# Altium project smart green_house.PrjPcb
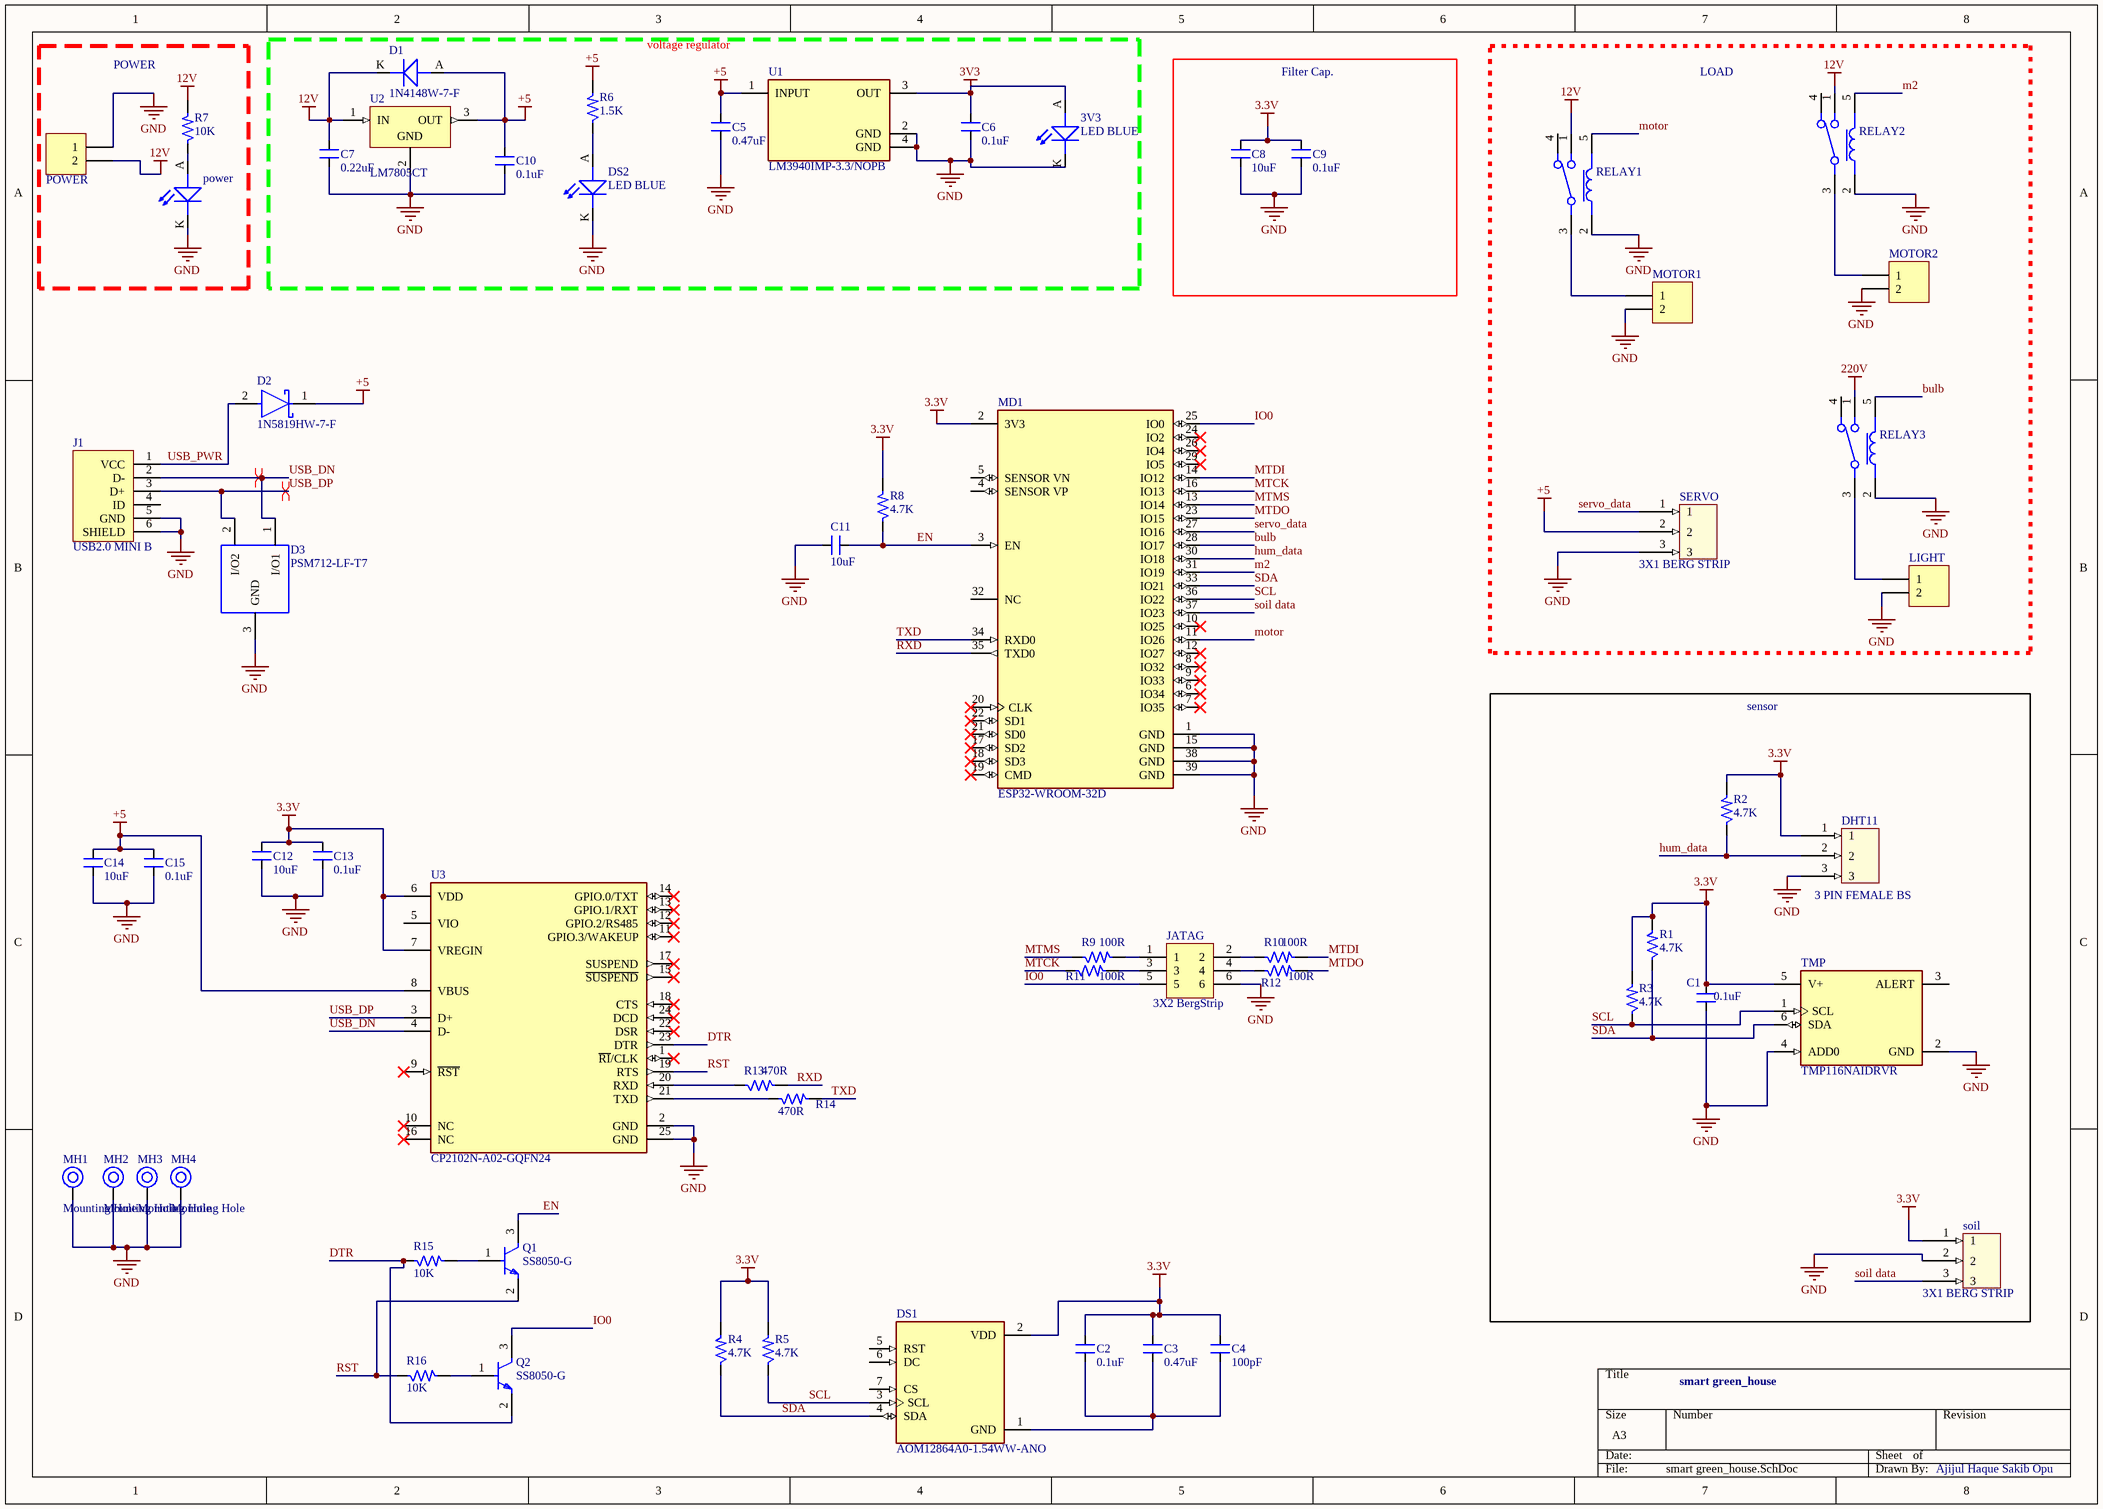
[diagram p0: smart green_house.SchDoc]
1 sheet, 61 parts. Net scope: global (net labels, ports and power ports of the same name join across sheets).
Board file: smart green_house.PcbDoc

## Sheet smart green_house.SchDoc: smart green_house
size A3; Author: Ajijul Haque Sakib Opu; SheetNumber: 1; SheetTotal: 1

### Parts
(Parts that share a designator on the sheet are numbered #1, #2 ... from top to bottom, then left to right.)
3V3  LED BLUE  [LED_0805]
C1  0.1uF  [CAP_0805]
C2  0.1uF  [CAP_0805]
C3  0.47uF  [CAP_0805]
C4  100pF  [CAP_0805]
C5  0.47uF  [CAP_0805]
C6  0.1uF  [CAP_0805]
C7  0.22uF  [CAP_0805]
C8  10uF  [CAP_1206]
C9  0.1uF  [CAP_0805]
C10  0.1uF  [CAP_0805]
C11  10uF  [CAP_1206]
C12  10uF  [CAP_1206]
C13  0.1uF  [CAP_0805]
C14  10uF  [CAP_1206]
C15  0.1uF  [CAP_0805]
D1  1N4148W-7-F  [DIO_SOD-123]
D2  1N5819HW-7-F  [FP-SOD123-IPC_A]
D3  PSM712-LF-T7  [SOT 23-3]
DHT11  3 PIN FEMALE BS  [CON3_100_40D72_TH_ST-FEMALE]
DS1  AOM12864A0-1.54WW-ANO  [LCD_AOM12864A0-1.54WW-ANO]
DS2  LED BLUE  [LED_0805]
J1  USB2.0 MINI B  [CON_690-005-299-043]
JATAG  3X2 BergStrip  [CON6_100_59D78_TH_ST_Duplicate]
LIGHT  2X1 TERMINAL BLOCK  [CON2_P137_691103110002_TH_ST]  (value not drawn)
MD1  ESP32-WROOM-32D  [FP-ESP32-WROOM-32D-MFG]
MH1  Mounting Hole  [MOUNTING]
MH2  Mounting Hole  [MOUNTING]
MH3  Mounting Hole  [MOUNTING]
MH4  Mounting Hole  [MOUNTING]
MOTOR1  2X1 TERMINAL BLOCK  [CON2_P137_691103110002_TH_ST]  (value not drawn)
MOTOR2  2X1 TERMINAL BLOCK  [CON2_P137_691103110002_TH_ST]  (value not drawn)
POWER#1  2X1 TERMINAL BLOCK  [CON2_P137_691103110002_TH_ST]  (value not drawn)
power#2  LED BLUE  [LED_0805]  (value not drawn)
Q1  SS8050-G  [FP-SS8050-G-MFG]
Q2  SS8050-G  [FP-SS8050-G-MFG]
R1  4.7K  [RES_0603]
R2  4.7K  [RES_0603]
R3  4.7K  [RES_0603]
R4  4.7K  [RES_0603]
R5  4.7K  [RES_0603]
R6  1.5K  [RES_0805]
R7  10K  [RES_0805]
R8  4.7K  [RES_0603]
R9  100R  [RES_0603]
R10  100R  [RES_0603]
R11  100R  [RES_0603]
R12  100R  [RES_0603]
R13  470R  [RES_0805]
R14  470R  [RES_0805]
R15  10K  [RES_0603]
R16  10K  [RES_0603]
RELAY1  JQC-3F-5VDC  [RLY_JQC_3F_5VDC]  (value not drawn)
RELAY2  JQC-3F-5VDC  [RLY_JQC_3F_5VDC]  (value not drawn)
RELAY3  JQC-3F-5VDC  [RLY_JQC_3F_5VDC]  (value not drawn)
SERVO  3X1 BERG STRIP  [CON3_100_40D72_TH_ST-MALE]
soil  3X1 BERG STRIP  [CON3_100_40D72_TH_ST-MALE]
TMP  TMP116NAIDRVR  [FP-DRV0006B-MFG]
U1  LM3940IMP-3.3/NOPB  [FP-DCY0004A-MFG]
U2  LM7805CT  [FAIR-TO-220-3]
U3  CP2102N-A02-GQFN24  [FP-CP2102N-A02-GQFN24-MFG]

### Blocks framed on the sheet
POWER: POWER#1 power#2 R7
voltage regulator: 3V3 C5-C7 C10 D1 DS2 R6 U1 U2
Filter Cap.: C8 C9
LOAD: LIGHT MOTOR1 MOTOR2 RELAY1-RELAY3 SERVO
sensor: C1 DHT11 R1-R3 soil TMP

### Nets
3.3V: C1.2 C2.2 C3.2 C4.2 C8.2 C9.2 C12.2 C13.2 DHT11.1 DS1.2(VDD) MD1.2(3V3) R1.2 R2.2 R3.2 R4.2 R5.2 R8.2 soil.1 TMP.5(V+) U3.6(VDD) U3.7(VREGIN)
3V3: 3V3.A(ANODE) C6.2 U1.3(OUT)
12V: C7.2 D1.K(CATHODE) POWER#1.2 R7.2 RELAY1.1 RELAY2.1 U2.1(IN)
220V: RELAY3.1
+5: C5.2 C10.2 C14.2 C15.2 D1.A(ANODE) D2.1(C) R6.2 SERVO.2 U1.1(INPUT) U2.3(OUT) U3.8(VBUS)
GND: 3V3.K(CATHODE) C1.1 C5.1 C6.1 C7.1 C8.1 C9.1 C10.1 C11.2 C12.1 C13.1 C14.1 C15.1 D3.3(GND) DHT11.3 DS2.K(CATHODE) J1.5(GND) J1.6(SHIELD) JATAG.6 LIGHT.2 MD1.1(GND) MD1.15(GND) MD1.38(GND) MD1.39(GND) MH1.1 MH2.1 MH3.1 MH4.1 MOTOR1.2 MOTOR2.2 POWER#1.1 power#2.K(CATHODE) RELAY1.2 RELAY2.2 RELAY3.2 SERVO.3 soil.2 TMP.2(GND) TMP.4(ADD0) U1.2(GND) U1.4(GND) U2.2(GND) U3.2(GND) U3.25(GND)
bulb: MD1.28(IO17) RELAY3.5
DTR: Q2.2(E) R15.1 U3.23(DTR)
EN: C11.1 MD1.3(EN) Q1.3(C) R8.1
hum_data: DHT11.2 MD1.30(IO18) R2.1
IO0: JATAG.5 MD1.25(IO0) Q2.3(C)
m2: MD1.31(IO19) RELAY2.5
motor: MD1.11(IO26) RELAY1.5
MTCK: MD1.16(IO13) R11.1
MTDI: MD1.14(IO12) R10.2
MTDO: MD1.23(IO15) R12.2
MTMS: MD1.13(IO14) R9.1
RST: Q1.2(E) R16.1 U3.19(RTS)
RXD: MD1.35(TXD0) R13.2
SCL: DS1.3(SCL) MD1.36(IO22) R3.1 R5.1 TMP.1(SCL)
SDA: DS1.4(SDA) MD1.33(IO21) R1.1 R4.1 TMP.6(SDA)
servo_data: MD1.27(IO16) SERVO.1
soil data: MD1.37(IO23) soil.3
TXD: MD1.34(RXD0) R14.2
USB_DN: D3.1(I/O1) J1.2(D-) U3.4(D-)
USB_DP: D3.2(I/O2) J1.3(D+) U3.3(D+)
USB_PWR: D2.2(A) J1.1(VCC)
NetC2_1: C2.1 C3.1 C4.1 DS1.1(GND)
NetDS2_A: DS2.A(ANODE) R6.1
NetJATAG_1: JATAG.1 R9.2
NetJATAG_2: JATAG.2 R10.1
NetJATAG_3: JATAG.3 R11.2
NetJATAG_4: JATAG.4 R12.1
NetLIGHT_1: LIGHT.1 RELAY3.3
NetMOTOR1_1: MOTOR1.1 RELAY1.3
NetMOTOR2_1: MOTOR2.1 RELAY2.3
Netpower#2_A: power#2.A(ANODE) R7.1
NetQ1_1: Q1.1(B) R15.2
NetQ2_1: Q2.1(B) R16.2
NetR13_1: R13.1 U3.20(RXD)
NetR14_1: R14.1 U3.21(TXD)

Not connected (* = marked no-connect by the designer): DS1 5(RST) 6(DC) 7(CS); J1 4(ID); MD1 4(SENSOR_VP) 5(SENSOR_VN) 6(IO34)* 7(IO35)* 8(IO32)* 9(IO33)* 10(IO25)* 12(IO27)* 17(SD2)* 18(SD3)* 19(CMD)* 20(CLK)* 21(SD0)* 22(SD1)* 24(IO2)* 26(IO4)* 29(IO5)* 32(NC); RELAY1 4; RELAY2 4; RELAY3 4; TMP 3(ALERT); U3 1(~{RI}/CLK)* 5(VIO) 9(~{RST})* 10(NC)* 11(GPIO.3/WAKEUP)* 12(GPIO.2/RS485)* 13(GPIO.1/RXT)* 14(GPIO.0/TXT)* 15(~{SUSPEND})* 16(NC)* 17(SUSPEND)* 18(CTS)* 22(DSR)* 24(DCD)*

### Layout directives
differential pair; differential pair class usb100: USB_DN, USB_DP

### Library data of the parts
3V3 DS2 power#2 = LED_BLUE-3V3-20mA-0805: Blue 470nm LED Indication - Discrete 3.3V 0805 (2012 Metric); Manufacturer: Vishay Lite-On; Manufacturer Part Number: LTST-C171TBKT; Alternate Part Number-1: NA; Case/Package: 0805; Supplier-1: SP ROAD; Supplier Part Number-1: LTST-C171TBKT
C1 C2 C9 C13 C15 = CAP_0.1uF-50V-20%-0805: 0.1µF ±20% 50V Ceramic Capacitor X7R 0805 (2012 Metric); Manufacturer: Samsung Electro-Mechanics; Manufacturer Part Number: CL21B104MBCNNNC; Alternate Part Number-1: NA; Case/Package: 0805; Supplier-1: SIRICOM; Supplier Part Number-1: 0805B104K500CT
C3 C5 = CAP_0.47uF-50V-5%-0805: 0.47µF ±5% 50V Ceramic Capacitor X7R 0805 (2012 Metric); Manufacturer: KEMET; Manufacturer Part Number: C0805C474J5RACTU; Alternate Part Number-1: 0805F474M500NT; Case/Package: 0805; Supplier-1: SIRICOM; Supplier Part Number-1: CL21B474KBNNNE
C4 = CAP_100pF-50V-5%-0805: 100pF ±5% 50V Ceramic Capacitor C0G, NP0 0805 (2012 Metric); Manufacturer: KEMET; Manufacturer Part Number: CC0805JRNPO9BN101; Alternate Part Number-1: NA; Case/Package: 0805; Supplier-1: SIRICOM; Supplier Part Number-1: 0805N101J500LT
C6 C10 = CAP_0.1uF-50V-10%-0805: 0.1µF ±10% 50V Ceramic Capacitor X7R 0805 (2012 Metric); Manufacturer: Samsung; Manufacturer Part Number: CL21B104KBCNNNC; Alternate Part Number-1: NA; Case/Package: 0805; Supplier-1: SIRICOM; Supplier Part Number-1: 0805B104K500CT
C7 = CAP_0.22uF-50V-10%-0805: 0.22µF ±10% 50V Ceramic Capacitor X7R 0805 (2012 Metric); Manufacturer: Murata; Manufacturer Part Number: GRM21BR71H224KA01L; Alternate Part Number-1: 0805F224M500NT; Case/Package: 0805; Supplier-1: SIRICOM; Supplier Part Number-1: 0805B224K500CT
C8 C11 C12 C14 = CAP_10uF-50V-10%-1206: 10µF ±10% 50V Ceramic Capacitor X7R 1206 (3216 Metric); Manufacturer: KEMET; Manufacturer Part Number: CL31B106KBHNNNE; Alternate Part Number-1: GRT31CR61H106ME01L; Case/Package: 1206; Supplier-1: SIRICOM; Supplier Part Number-1: CC1206KKX5R9BB106
D1 = DIO_100V-300mA-SOD123: Diode Standard 100V 300mA (DC) Surface Mount SOD-123; Manufacturer: FAIRCHILD; Alternate Part Number-1: NA; Manufacturer Part Number: 1N4148W-7-F; Case/Package: SOD123; Supplier-1: SIRICOM; Supplier Part Number-1: 1N4148W-7-F
D2 = CMP-0303-00003-3: DIODE SCHOTTKY 40V 1A SOD123; Forward Voltage: 450mV; Capacitance: 110pF; Max Forward Surge Current (Ifsm): 25A; Peak Reverse Current: 50uA; Polarity: Standard; Element Configuration: Single; Max Power Dissipation: 450mW; Min Operating Temperature: -65°C; Package Quantity: 3000; Contact Plating: Tin; Weight: 0.000353oz; Max Repetitive Reverse Voltage (Vrrm): 40V; Max Reverse Voltage (DC): 40V; Height: 1.25mm; Average Rectified Current: 1A; Width: 1.7mm; Case/Package: SOD-123-2; Lead Free: Lead Free; Max Operating Temperature: 125°C; Current Rating: 1A; Termination: SMD/SMT; Forward Current: 1A; Radiation Hardening: No; Number of Pins: 2; Length: 2.85mm; Voltage Rating (DC): 40V; REACH SVHC: No SVHC; Peak Non-Repetitive Surge Current: 25A; Packaging: Tape and Reel; Output Current: 1A
D3 = DIO-A_PSM712-SOT23: ESD Suppressor TVS Bi-Dir 12V/7V 3-Pin SOT-23 T/R; Manufacturer: Protek Devices; Alternate Part Number-1: NA; Manufacturer Part Number: PSM712-LF-T7; Case/Package: SOT-23; Supplier-1: LCSC; Supplier Part Number-1: PSM712-LF-T7
DHT11 = CON-BS-SKT_3X1-100-ST-TH: 3 Pins, 1 Row 2.54mm Pitch, Straight bergstrip, Female; Manufacturer Part Number: 68000-103HLF; Manufacturer: FCI / Amphenol; Alternate Part Number-1: NA; Case/Package: TH-CON; Supplier-1: SP ROAD; Supplier Part Number-1: NA
DS1 = AOM12864A0-1.54WW-ANO: Non-Touch Graphic LCD Display Module - White OLED SPI 1.54 (39.12mm) 128 x 64; MF: Orient Display; Price: None; Value: *; Package: None; Check_prices: https://www.snapeda.com/parts/AOM12864A0-1.54WW-ANO/Orient+Display/view-part/?ref=eda; SnapEDA_Link: https://www.snapeda.com/parts/AOM12864A0-1.54WW-ANO/Orient+Display/view-part/?ref=snap; Purchase-URL: https://pricing.snapeda.com/search/part/AOM12864A0-1.54WW-ANO/?ref=eda; Availability: In Stock; MP: AOM12864A0-1.54WW-ANO
J1 = CON_USB2.0-MINIB-SMD: USB - mini B USB 2.0 Receptacle Connector 5 Position Surface Mount, Right Angle; Manufacturer: EDAC; Manufacturer Part Number: 690-005-299-043; Alternate Part Number-1: NA; Case/Package: USB-MINI-B; Supplier-1: LCSC; Supplier Part Number-1: C105424
JATAG = CON-BS-PLG_3X2-100-ST-TH: 6 Pins, 2 Row 2.54mm Pitch, Straight bergstrip, Male; Manufacturer: NA; Manufacturer Part Number: NA; Case/Package: TH; Supplier-1: SP ROAD; Supplier Part Number-1: NA; Alternate Part Number-1: NA
LIGHT MOTOR1 MOTOR2 POWER#1 = CON-TB_2X1-137-ST-TH: 2 Pins, 1 Row 137mil Pitch, straight Connector, male; Manufacturer: Wurth Electronics; Manufacturer Part Number: 691103110002; Alternate Part Number-1: NA; Case/Package: TH-CON; Supplier-1: SP ROAD; Supplier Part Number-1: 691103110002
MD1 = CMP-194065-000003-1: WIFI MODULE 32MBITS SPI FLASH; Manufacturer: Espressif Systems; Max Supply Voltage: 3.6V; Nominal Supply Current: 500mA; Max Frequency: 2484MHz; Number Of Adc Channels: 16; Number Of Gpio: 32; Interface: I2C,SPI,UART,Ethernet,I2S,Other; Data Rate: 150Mbits/s; Min Supply Voltage: 3V; Bandwidth: 72MHz; Sensitivity: -98dBm; Octopart: https://octopart.com/esp32-wroom-32d-espressif+systems-91040050; Package: ESP32-WROOM-32D; ComponentLink2URL: https://www.espressif.com/sites/default/files/documentation/esp32-wroom-32d_esp32-wroom-32u_datasheet_en.pdf; Lead Free: Yes; Category: UNK; Mouser Description: Wi-Fi/BT BLE Module ESP32-D0WD, SPI Flash, UART, P; Device Class L1: Integrated Circuits (ICs); RoHS: TRUE; Temperature Range Low: -40°C; ComponentLink2Description: Datasheet; Digikey Description: WIFI MODULE 32MBITS SPI FLASH; Height: 3.2mm; Temperature: -40°C to +85°C; Manufacturer Part Number: ESP32-WROOM-32D; Device Class L3: Transceivers; Device Class L2: RF Semiconductors and Devices; Temperature Range High: +85°C; Automotive: No
MH1-MH4 = MH_3.5H_6D: Manufacturer Part Number: NA; Case/Package: TH; Manufacturer: NA; Supplier-1: NA; Supplier Part Number-1: NA; Alternate Part Number-1: NA
Q1 Q2 = CMP-20235-000001-1: NPN TRANSISTOR 1.5A 40V SOT-23 R; Transition Frequency: 100MHz; Max Breakdown Voltage: 25V; Collector Emitter Voltage (VCEO): 400mV; Max Power Dissipation: 300mW; Max Collector Current: 1.5A; Case/Package: TO-236-3; Packaging: Tape and Reel; RoHS Compliant: Yes; Mount: Surface Mount; Collector Emitter Breakdown Voltage: 25V
R1-R5 R8 = RES_4.7K-0.1W-1%-0603: 4.7 kOhms ±1% 0.1W, 1/10W Chip Resistor 0603 (1608 Metric) Moisture Resistant Thick Film; Manufacturer: Walsin; Manufacturer Part Number: WR06X4701FTL; Alternate Part Number-1: MR06X4701FTL; Case/Package: 0603; Supplier-1: SIRICOM; Supplier Part Number-1: WR06X4701FTL
R6 R7 = RES_1.5K-0.125W-1%-0805: 1.5 kOhms ±1% 0.125W, 1/8W Chip Resistor 0805 (2012 Metric) Thick Film; Manufacturer: TE Connectivity Passive Product; Manufacturer Part Number: CRG0805F1K5; Alternate Part Number-1: NA; Case/Package: 0805; Supplier-1: SIRICOM; Supplier Part Number-1: NA
R9-R12 = RES_100R-0.1W-1%-0603: 100 Ohms ±1% 0.1W, 1/10W Chip Resistor 0603 (1608 Metric) Thick Film; Manufacturer: Walsin; Manufacturer Part Number: WR06X1000FTL; Alternate Part Number-1: MR06X1000FTL; Case/Package: 0603; Supplier-1: SIRICOM; Supplier Part Number-1: WALSIN:WR06X1000FTL
R13 R14 = RES_470R-0.125W-1%-0805: 470 Ohms ±1% 0.125W, 1/8W Chip Resistor 0805 (2012 Metric) Automotive AEC-Q200 Thick Film; Manufacturer: Walsin; Manufacturer Part Number: WR08X4700FTL; Alternate Part Number-1: NA; Case/Package: 0805; Supplier-1: SIRICOM; Supplier Part Number-1: WR08X4700FTL
R15 R16 = RES_10K-0.1W-1%-0603: 10 kOhms ±1% 0.1W, 1/10W Chip Resistor 0603 (1608 Metric) Automotive AEC-Q200 Thick Film; Manufacturer: Walsin; Manufacturer Part Number: WR06X1002FTL; Alternate Part Number-1: 0603WAJ0103T5E; Case/Package: 0603; Supplier-1: SIRICOM; Supplier Part Number-1: WR06X1002FTL
RELAY1-RELAY3 = RLY2_5V-7.5A: 5V DC RELAY 2 CHANNEL; Manufacturer: YUEQING HENGWEI ELECTRONICS; Alternate Part Number-1: NA; Manufacturer Part Number: JQC-3F-5VDC; Case/Package: RLY_JQC-3F-5DC; Supplier-1: SP ROAD; Supplier Part Number-1: JQC-3F-5VDC
SERVO soil = CON-BS-PLG_3X1-100-ST-TH: 3 Pins, 1 Row 2.54mm Pitch, Straight bergstrip, Male; Manufacturer: NA; Manufacturer Part Number: RKI-1140; Case/Package: TH-CON; Supplier-1: SP ROAD; Supplier Part Number-1: NA; Alternate Part Number-1: NA
TMP = CMP-04948-000013-1: SENSOR DIGITAL -55C-125C 6WSON; Manufacturer: Texas Instruments; Sensor Output: I2C,SMBus; Max Junction Temp: +150°C; Standoff Height: 0mm; Min Supply Voltage: 1.9V; Max Supply Voltage: 5.5V; Resolution: 16bits; Operating Supply Current: 3.5-135uA; Manufacturer Part Number: TMP116NAIDRVR; Temperature Range Low: -55°C; Temperature: -55°C to +125°C; Ipc Land Pattern Name: DFN200X200X80-6; Device Class L1: Sensors; Package: DRV0006B; Interface: I2C,SMBus; Device Class L3: unset; Ambient Temperature Range Low: -55°C; Lead Free: Yes; Height: 0.8mm; Temperature Range High: +125°C; Digikey Description: SENSOR DIGITAL -55C-125C 6WSON; RoHS: TRUE; Mouser Description: ±0.2°C Accurate Digital Temperature Sensor With NV Memory 6-WSON -55 to 125; Ambient Temperature Range High: +150°C; ComponentLink2Description: Datasheet; Category: IC; Device Class L2: Temperature and Humidity Sensors; ComponentLink2URL: https://www.ti.com/lit/ds/symlink/tmp116.pdf; Octopart: https://octopart.com/tmp116naidrvr-texas+instruments-82367758; Automotive: No
U1 = CMP-0062-01788-4: IC REG LINEAR 3.3V 1A SOT223-4; Min Input Voltage: 4.5V; Max Supply Voltage: 7.5V; Number of Outputs: 1; Output Type: Fixed; Polarity: Positive; Dropout Voltage: 500mV; Quiescent Current: 15mA; Max Output Voltage: 3.3V; Length: 6.5mm; Termination: SMD/SMT; Width: 3.56mm; Min Supply Voltage: 4.5V; Max Output Current: 1A; Case/Package: SOT-223; Output Voltage: 3.3V; Current Rating: 1A; Packaging: Tape and Reel; Lead Free: Lead Free; Nominal Output Voltage: 3.3V; Height: 1.6mm; Series: -; Output Configuration: Positive; Radiation Hardening: No; Number of Regulators: 1; Package Quantity: 1000; REACH SVHC: No SVHC; Max Input Voltage: 7.5V; Max Operating Temperature: 125°C; Min Operating Temperature: -40°C; Output Current: 1A; Contact Plating: Tin; Number of Pins: 4; Mount: Surface Mount
U2 = CMP-2000-04938-1: Positive Voltage Regulator, 5 V, 1 A, -40 to 125 degC, 3-Pin TO-220, RoHS, Tube; Manufacturer: FairchildSemiconductor; Maximum Input Voltage: 35V; Maximum Quiescent Current: 8mA; Load Regulation: 100mV; Maximum Output Current: 2.2(Typ)A; Output Type: Fixed; Typical Dropout Voltage @ Current: 2@1AV; Rad Hard: No; Output Voltage: 5V; Accuracy: ±4%; Number of Outputs: 1; Category: LinearRegulator; Package Description: 3-Pin Through Hole Device, Body 10 x 4.5 mm, Pitch 2.54 mm; Packaging: Rail/Tube; Mounting: ThroughHole; Polarity: Positive; Manufacturer URL: https://www.fairchildsemi.com/; Line Regulation: 100mV; Datasheet Version: Aug-12; Datasheet URL: https://datasheet.ciiva.com/26904/lm7805ct-26904988.pdf; Package Reference: TO-220; Package URL: https://www.fairchildsemi.com/package-drawings/TO/TO220B03.pdf; Package: 3TO-220AB; Operating Temperature: -40to125degC; Type: Linear
U3 = CMP-08107-000010-1: IC USB TO UART BRIDGE QFN24